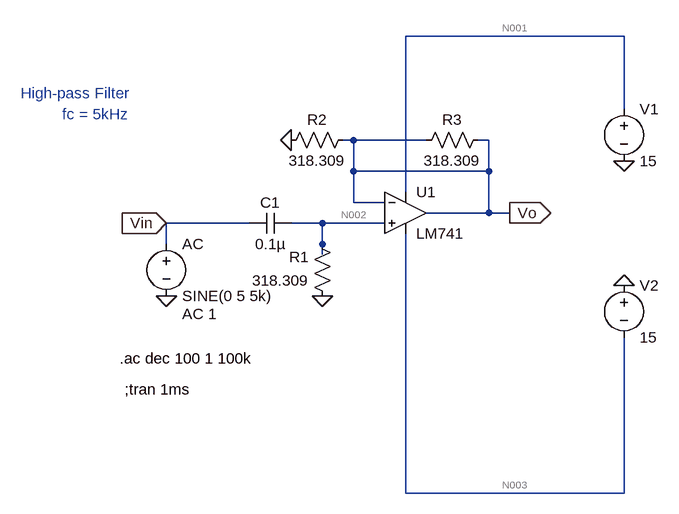
[diagram p0: schematic Filter_HighPass.asc]
Filter_HighPass.asc, the LTspice schematic file:
Version 4
SHEET 1 880 680
WIRE 592 -96 256 -96
WIRE 592 16 592 -96
WIRE 176 64 160 64
WIRE 288 64 176 64
WIRE 384 64 368 64
WIRE 176 112 176 64
WIRE 384 112 384 64
WIRE 384 112 176 112
WIRE 256 144 256 -96
WIRE 176 160 176 112
WIRE 224 160 176 160
WIRE 384 176 384 112
WIRE 384 176 288 176
WIRE 416 176 384 176
WIRE 16 192 -112 192
WIRE 128 192 80 192
WIRE 224 192 128 192
WIRE -112 224 -112 192
WIRE 128 224 128 192
WIRE 128 240 128 224
WIRE 256 608 256 208
WIRE 592 608 592 368
WIRE 592 608 256 608
FLAG -112 304 0
FLAG 592 288 0
FLAG 592 96 0
FLAG 128 304 0
FLAG 416 176 Vo
IOPIN 416 176 Out
FLAG -112 192 Vin
IOPIN -112 192 In
FLAG 80 64 0
SYMBOL voltage 592 0 R0
SYMATTR InstName V1
SYMATTR Value 15
SYMBOL voltage 592 272 R0
SYMATTR InstName V2
SYMATTR Value 15
SYMBOL voltage -112 208 R0
WINDOW 123 24 124 Left 2
WINDOW 39 0 0 Left 0
SYMATTR Value2 AC 1
SYMATTR InstName AC
SYMATTR Value SINE(0 5 5k)
SYMBOL cap 80 176 R90
WINDOW 0 0 32 VBottom 2
WINDOW 3 32 32 VTop 2
SYMATTR InstName C1
SYMATTR Value 0.1µ
SYMBOL res 144 320 R180
WINDOW 0 36 76 Left 2
WINDOW 3 36 40 Left 2
SYMATTR InstName R1
SYMATTR Value 318.309
SYMATTR SpiceLine tol=-10
SYMBOL OpAmps\\LM741 256 112 R0
SYMATTR InstName U1
SYMBOL res 176 48 R90
WINDOW 0 0 56 VBottom 2
WINDOW 3 32 56 VTop 2
SYMATTR InstName R2
SYMATTR Value 318.309
SYMATTR SpiceLine tol=-10
SYMBOL res 384 48 R90
WINDOW 0 0 56 VBottom 2
WINDOW 3 32 56 VTop 2
SYMATTR InstName R3
SYMATTR Value 318.309
SYMATTR SpiceLine tol=-10
TEXT -184 400 Left 2 !.ac dec 100 1 100k
TEXT -176 448 Left 2 !;tran 1ms
TEXT -336 -8 Left 2 ;High-pass Filter
TEXT -272 24 Left 2 ;fc = 5kHz

The netlist it stands for:
* Filter_HighPass.asc
V1 N001 0 15
V2 0 N003 15
V§AC Vin 0 SINE(0 5 5k) AC 1
C1 N002 Vin 0.1µ
R1 0 N002 318.309 tol=-10
XU1 N002 Vo N001 N003 Vo LM741  ; pins In+ In- V+ V- OUT
R2 Vo 0 318.309 tol=-10
R3 Vo Vo 318.309 tol=-10
.ac dec 100 1 100k
;tran 1ms
* High-pass Filter
* fc = 5kHz
.lib LM741.lib
.backanno
.end

* Results of the author's LTspice run, read from the files saved beside the schematic
* Operating Point, zero values left out:
*   V(n001) = 15 V
*   V(n003) = -15 V
*   V(n002) = -18.42 µV
*   V(vo) = 981.6 µV
*   I(R2) = 3.084 µA
*   I(R1) = 57.86 nA
*   I(V2) = -1.7 mA
*   I(V1) = -1.703 mA
*   Ix(u1:1) = 57.86 nA
*   Ix(u1:2) = 101.9 nA
*   Ix(u1:99) = 1.703 mA
*   Ix(u1:50) = -1.7 mA
*   Ix(u1:28) = -3.186 µA
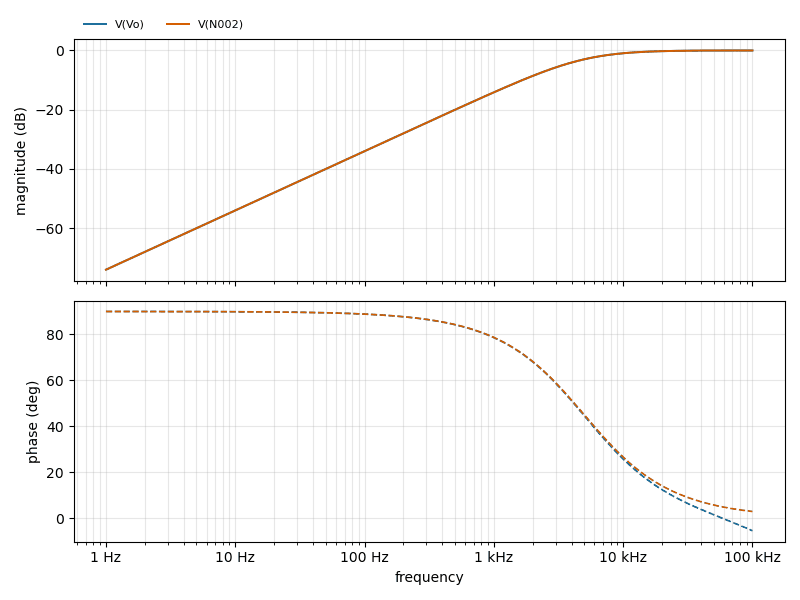
[diagram p1: AC Analysis of Filter_HighPass.asc, plotted from the saved traces]
* AC Analysis, 1 run:
*   V(Vo): -73.98 dB at 1 Hz, -0.05 dB at 100 kHz, peak -0.04 dB at 70.79 kHz, 3 dB below the peak at 4.952 kHz
*   V(N002): -73.98 dB at 1 Hz, -0.01 dB at 100 kHz, peak -0.01 dB at 100 kHz, 3 dB below the peak at 4.988 kHz